# Altium schematic sheet Relay_Circuit.SchDoc: <Document>
size Letter; Engineer: <Engineer>; Organization: UPEL; Address1: USU Power Electronics Lab; Address2: USTAR Building 620, RM 118; Address3: 1600 N 620 E; Address4: North Logan, UT 84341; DocumentNumber: 2; Revision: v1; SheetNumber: 2; SheetTotal: 16; ProjectName: <Project>
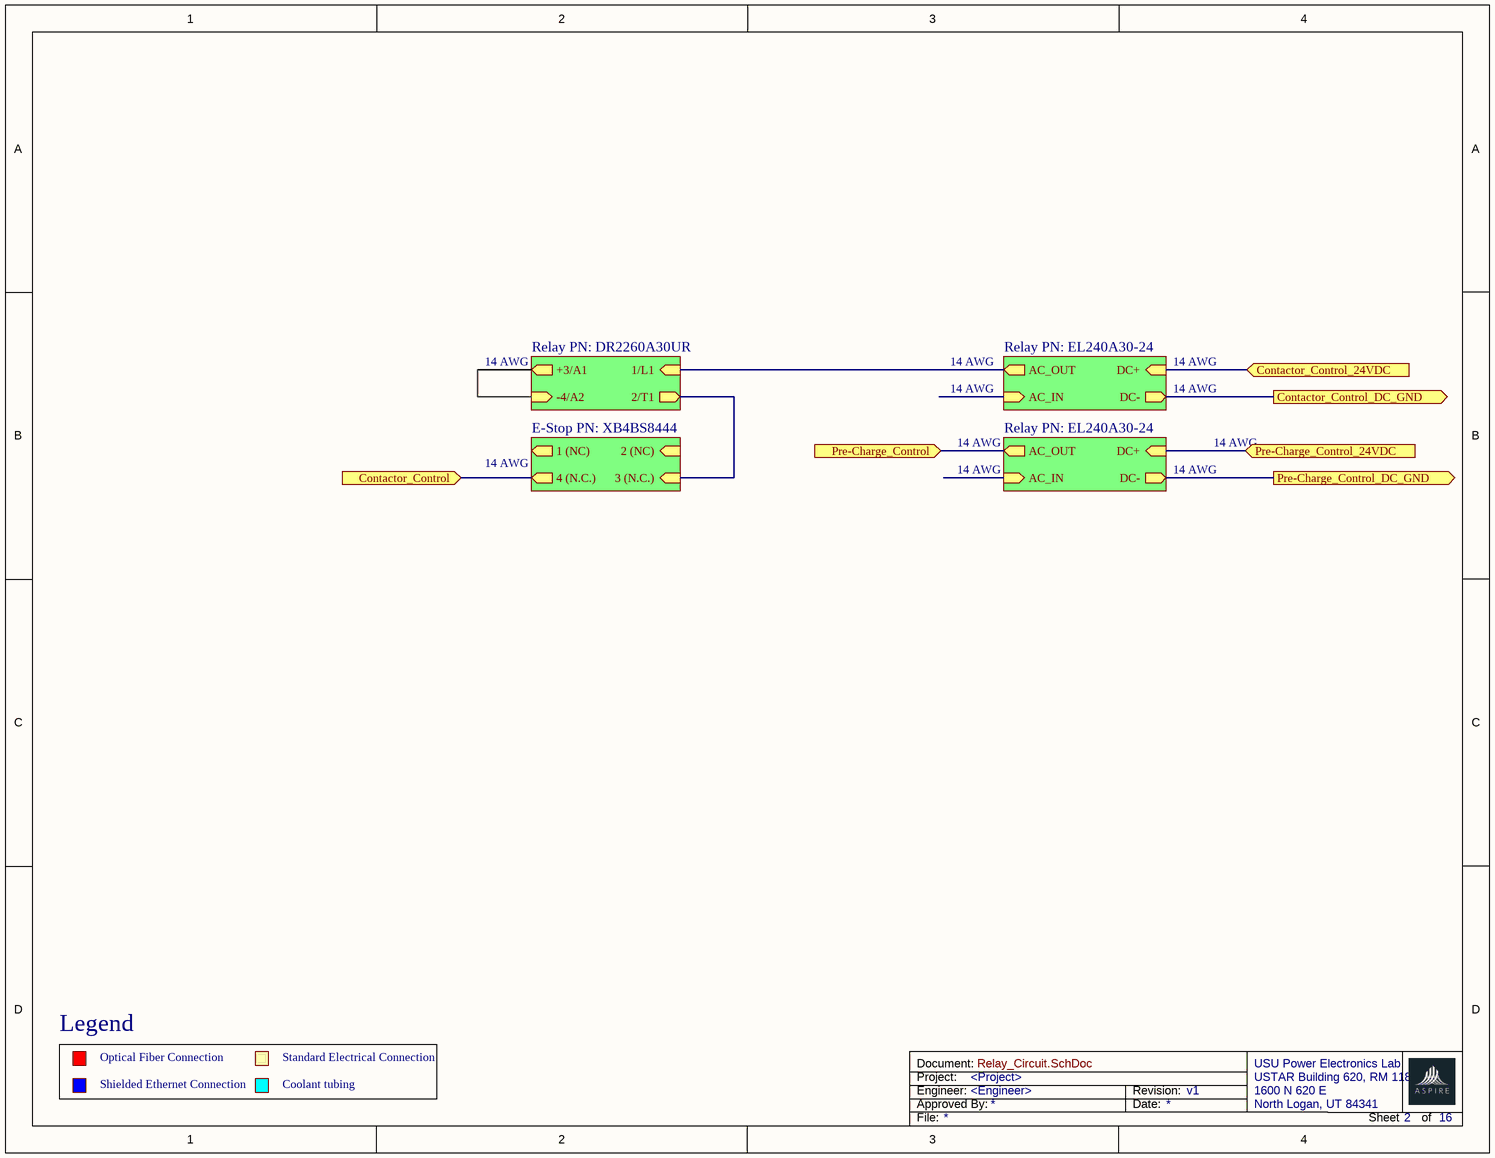
[diagram p0: Relay_Circuit.SchDoc]

## Sub-sheets
E-Stop PN: XB4BS8444 = File Name: 4 (N.C.) (out), 3 (N.C.) (in), 1 (NC) (out), 2 (NC) (in)
Relay PN: DR2260A30UR = File Name: -4/A2 (in), +3/A1 (out), 1/L1 (in), 2/T1 (out)
Relay PN: EL240A30-24 = File Name: AC_IN (in), AC_OUT (out), DC+ (in), DC- (out)
Relay PN: EL240A30-24 = File Name: AC_IN (in), AC_OUT (out), DC+ (in), DC- (out)

## Ports
Contactor_Control (in), Contactor_Control_24VDC (in), Contactor_Control_DC_GND (out), Pre-Charge_Control (in), Pre-Charge_Control_24VDC (in), Pre-Charge_Control_DC_GND (out)

## Nets
Contactor_Control: port Contactor_Control, sheet E-Stop PN: XB4BS8444/4 (N.C.)
Contactor_Control_24VDC: port Contactor_Control_24VDC, sheet Relay PN: EL240A30-24/DC+
Contactor_Control_DC_GND: port Contactor_Control_DC_GND, sheet Relay PN: EL240A30-24/DC-
Pre-Charge_Control: port Pre-Charge_Control, sheet Relay PN: EL240A30-24/AC_OUT
Pre-Charge_Control_24VDC: port Pre-Charge_Control_24VDC, sheet Relay PN: EL240A30-24/DC+
Pre-Charge_Control_DC_GND: port Pre-Charge_Control_DC_GND, sheet Relay PN: EL240A30-24/DC-
(unnamed): sheet Relay PN: EL240A30-24/AC_OUT, sheet Relay PN: DR2260A30UR/1/L1
(unnamed): sheet E-Stop PN: XB4BS8444/3 (N.C.), sheet Relay PN: DR2260A30UR/2/T1
(unnamed): sheet Relay PN: DR2260A30UR/-4/A2, sheet Relay PN: DR2260A30UR/+3/A1

## Notes on the sheet
- 14 AWG
- Legend
- Optical Fiber Connection
- Shielded Ethernet Connection
- Standard Electrical Connection
- Coolant tubing
- Project:
- Engineer:
- Document:
- Approved By:
- Date:
- Revision:
- File:
- Sheet
- of